# Altium schematic sheet Tay_Cam.SchDoc (part 3 of 3)
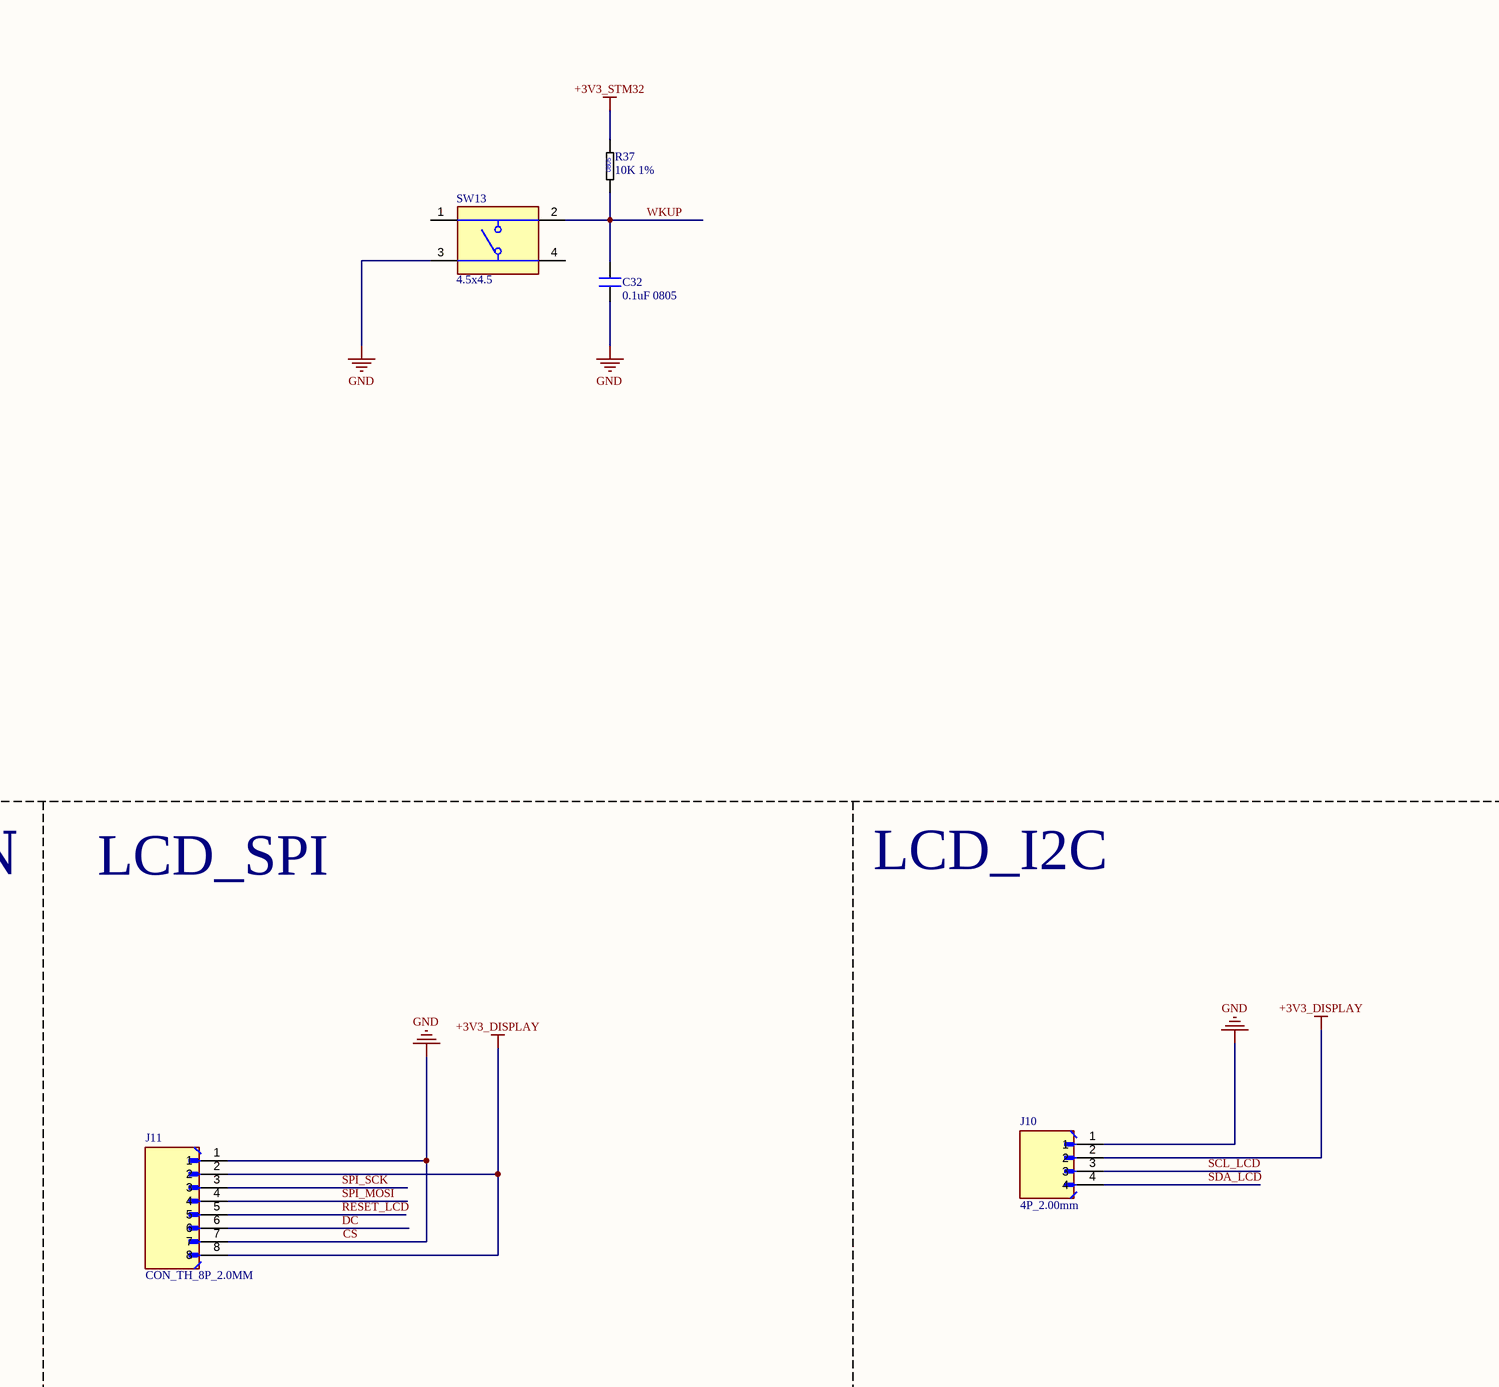
[diagram p9: Tay_Cam.SchDoc, bottom column 4 of 4]

## Library data of the parts (continued)
Q3 Q4 = TRANS-BJT_SMD; NPN 25V 1.5A SOT-23-3; SS8050-G: Trans Gp Bjt NPN 25V 1.5A 300MW 3-PIN SOT-23 T/r; Manufacturer Cross: Comchip; Transition Frequency: 100MHz; Collector-emitter Voltage-Max: 400mV; Collector Base Voltage (VCBO): 40V; Collector Emitter Saturation Voltage: 500mV; Emitter Base Voltage (VEBO): 5V; hFE Min: 200; Number of Elements: 1; LIBRARY MADE BY: MR. XUAN SIEU; Supplier 1: Digikey; Manufacturer Part Number: SS8050-G; RoHS: Yes; Category: Transistors; Stock 1: 130674; Pricing 1: 1=0.24, 10=0.148, 100=0.0921, 500=0.06754, 1000=0.05958 (USD); Mount: Surface Mount; Case/Package: TO-236-3; Max Operating Temperature: 150°C; Packaging: Cut Tape; Max Collector Current: 1.5A; Max Power Dissipation: 300mW; Collector Emitter Breakdown Voltage: 25V; Max Breakdown Voltage: 25V; Series: -; Power Dissipation: 300mW; Height: 1.15mm; RoHS Compliant: Yes; ComponentLink1URL: http://www.comchiptech.com/admin/files/product/SS8050-G RevA181526.pdf?src-supplier=Digikey; ComponentLink1Description: http://www.comchiptech.com/admin/files/product/SS8050-G RevA181526.pdf?src-supplier=Digikey; ComponentLink2Description: Link Viet Nam; ComponentLink2URL: https://linhkien.cxtvn.com/6446-mmss8050-l-tp-transistor-npn-25v-15a-sot-23.html; ComponentLink3Description: Link Original; ComponentLink3URL: https://www.digikey.com/en/products/detail/comchip-technology/SS8050-G/6138901; ComponentLink4Description: Link Cross; ComponentLink4URL: https://www.lcsc.com/product-detail/Bipolar-BJT_Comchip-SS8050-G_C3199946.html?s_z=n_SS8050-G; Supplier Part Number 1: 641-1790-1-ND
R1 R2 R5 R7 R19 R23 R29 = RES_SMD; 4.7K, 1%, 0805, 1/8W: Res Thick Film 0805 4.7K Ohm 1% 1/8W ±100ppm/°C Molded SMD Paper T/R; Manufacturer Cross: Vishay; Manufacturer Part Number: CRCW08054K70FKEAC; Voltage Rating: 150V; LIBRARY MADE BY: MR. XUAN SIEU; Supplier 1: Digikey; RoHS: Yes; Category: Chip SMD Resistors; Stock 1: 866093; Pricing 1: 1=0.1, 10=0.041, 100=0.0208, 1000=0.01059, 2500=0.00988, 5000=0.00661, 10000=0.00546, 15000=0.00542, 25000=0.00537, 35000=0.00535, 50000=0.00532, 125000=0.00526, 250000=0.00523, 500000=0.00519 (USD); Height: 600um; Lead Free: 5697LeadFree; ComponentLink1URL: http://www.vishay.com/docs/28773/crcwce3.pdf?src-supplier=Digikey; ComponentLink1Description: http://www.vishay.com/docs/28773/crcwce3.pdf?src-supplier=Digikey; ComponentLink2URL: https://datasheet.octopart.com/CRCW08054K70FKEAC-Vishay-datasheet-100063072.pdf?src-supplier=Future+Electronics; ComponentLink2Description: https://datasheet.octopart.com/CRCW08054K70FKEAC-Vishay-datasheet-100063072.pdf?src-supplier=Future+Electronics; ComponentLink3Description: Link Original; ComponentLink3URL: https://www.digikey.com/en/products/detail/vishay-dale/CRCW08054K70FKEAC/7928553; ComponentLink4Description: Link Cross; ComponentLink4URL: https://www.lcsc.com/product-detail/Chip-Resistor-Surface-Mount_Vishay-Intertech-CRCW08054K70FKEAC_C844630.html?s_z=n_CRCW08054K70FKEAC; ComponentLink5Description: Link Viet Nam; ComponentLink5URL: https://linhkien.cxtvn.com/11332-dien-tro-0805-1-thong-so-tu-1k-den-91k.html; Supplier Part Number 1: 541-4131-1-ND
R3 R20 = R-SM: 10kΩ 100mW 75V ±1% ±100ppm/℃ Thick Film Resistor 0603 Chip Resistor - Surface Mount ROHS; Manufacturer: YAGEO; Ten thuong mai: Dien tro dan 0603 ?K 1%; User: 1; Package: 0603; Mfr. Part #: *; Link VN: *; Link QT: *; ComponentLink1Description: New link; ComponentLink1URL: *
R4 R21 = R-SM_4: 10kΩ 100mW 75V ±1% ±100ppm/℃ Thick Film Resistor 0603 Chip Resistor - Surface Mount ROHS; Manufacturer: YAGEO; Ten thuong mai: Dien tro dan 0603 ?K 1%; User: 1; Package: 0603; Mfr. Part #: *; Link VN: *; Link QT: *; ComponentLink1Description: New link; ComponentLink1URL: *
R6 R22 = R-SM_1: 10kΩ 100mW 75V ±1% ±100ppm/℃ Thick Film Resistor 0603 Chip Resistor - Surface Mount ROHS; Manufacturer: YAGEO; Ten thuong mai: Dien tro dan 0603 ?K 1%; User: 1; Package: 0603; Mfr. Part #: *; Link VN: *; Link QT: *; ComponentLink1Description: New link; ComponentLink1URL: *
R8 R34 = RES_SMD; 47K, 1%, 0805, 1/8W: 125Mw Thick Film Resistors 100Ppm/ 1% 47K 0805 Chip Resistor Surface Mount Rohs; Manufacturer: Yageo; Manufacturer Part Number: RC0805FR-0747KL; Voltage Rating (DC): 150V; Resistance: 47kR; Temperature Coefficient: 100ppm/°C; LIBRARY MADE BY: MR. XUAN SIEU; Supplier 1: Digikey; RoHS: Yes; Category: Chip SMD Resistors; Stock 1: 133607; Pricing 1: 1=0.1, 10=0.012, 100=0.0112, 1000=0.00816 (USD); Case/Package: 0805; Number of Pins: 2; Case Code (Imperial): 0805; Case Code (Metric): 2012; Contact Plating: Tin,Matte; Size Code: 0805; Min Operating Temperature: -55°C; Max Operating Temperature: 155°C; Tolerance: 1%; Packaging: Tape and Reel; Voltage Rating: 150V; Power Rating: 125mW; Termination: SMD/SMT; Number of Terminations: 2; Voltage Rating (AC): 150V; Resistor Type: Thick Film; Features: Moisture Resistant; Max Power Dissipation: 125mW; Series: RC; Resistance Tolerance: 1%; Length: 2mm; Width: 1.25mm; Height: 0.5mm; Lead Free: 5697LeadFree; Reach SVHC Compliant: Unknown; RoHS Compliant: Yes; ComponentLink1URL: https://datasheet.ciiva.com/7941/1686128-7941799.pdf?src-supplier=Element14; ComponentLink1Description: https://datasheet.ciiva.com/7941/1686128-7941799.pdf?src-supplier=Element14; ComponentLink2URL: https://datasheet.ciiva.com/46447/444164-46447581.pdf?src-supplier=Element14; ComponentLink2Description: https://datasheet.ciiva.com/46447/444164-46447581.pdf?src-supplier=Element14; ComponentLink3URL: https://datasheet.ciiva.com/7941/444164-7941800.pdf?src-supplier=Element14; ComponentLink3Description: https://datasheet.ciiva.com/7941/444164-7941800.pdf?src-supplier=Element14; ComponentLink4URL: https://datasheet.ciiva.com/7941/444164-7941801.pdf?src-supplier=Element14; ComponentLink4Description: https://datasheet.ciiva.com/7941/444164-7941801.pdf?src-supplier=Element14; ComponentLink5URL: https://datasheet.ciiva.com/16742/rc0805-16742265.pdf?src-supplier=Future+Electronics; ComponentLink5Description: https://datasheet.ciiva.com/16742/rc0805-16742265.pdf?src-supplier=Future+Electronics; Link Viet Nam: https://linhkien.cxtvn.com/1960-dien-tro-0805-5-thong-so-tu-1k-den-91k.html; Link Original: https://www.digikey.com/en/products/detail/yageo/RC0805FR-0747KL/727973; Supplier Part Number 1: 311-47.0KCRCT-ND
R9 R24 = R-SM_5: 10kΩ 100mW 75V ±1% ±100ppm/℃ Thick Film Resistor 0603 Chip Resistor - Surface Mount ROHS; Manufacturer: YAGEO; Ten thuong mai: Dien tro dan 0603 ?K 1%; User: 1; Package: 0603; Mfr. Part #: *; Link VN: *; Link QT: *; ComponentLink1Description: New link; ComponentLink1URL: *
R10 R28 = R-SM_2: 10kΩ 100mW 75V ±1% ±100ppm/℃ Thick Film Resistor 0603 Chip Resistor - Surface Mount ROHS; Manufacturer: YAGEO; Ten thuong mai: Dien tro dan 0603 ?K 1%; User: 1; Package: 0603; Mfr. Part #: *; Link VN: *; Link QT: *; ComponentLink1Description: New link; ComponentLink1URL: *
R11 R26 R32 R35 R37-R39 R43 = RES_SMD; 10K, 1%, 0805, 1/8W: SMD Chip Resistor, 10 kOhm, ± 1%, 125 mW, 0805 [2012 Metric], Thick Film, General Purpose; Manufacturer Cross: Stackpole Electronics; Manufacturer Part Number: RMCF0805FT10K0; Voltage Rating: 150V; LIBRARY MADE BY: MR. XUAN SIEU; Supplier 1: Digikey; RoHS: Yes; Category: Chip SMD Resistors; Stock 1: 1959497; Pricing 1: 1=0.1, 10=0.02, 50=0.0124, 100=0.0103, 500=0.007, 1000=0.00601 (USD); Lead Free: 5697LeadFree; ComponentLink1URL: https://datasheet.ciiva.com/15193/getdatasheetpartid-362046-15193525.pdf?src-supplier=Verical; ComponentLink1Description: https://datasheet.ciiva.com/15193/getdatasheetpartid-362046-15193525.pdf?src-supplier=Verical; Supplier Part Number 1: RMCF0805FT10K0CT-ND; ComponentLink2Description: Link Original; ComponentLink2URL: https://www.digikey.com/en/products/detail/stackpole-electronics-inc/RMCF0805FT10K0/1760676; ComponentLink3Description: Link Cross; ComponentLink3URL: https://www.lcsc.com/product-detail/Chip-Resistor-Surface-Mount_SEI-Stackpole-Elec-RMCF0805FT10K0_C237755.html; ComponentLink4Description: Link Viet Nam; ComponentLink4URL: https://linhkien.cxt.vn/8484-rc0805fr-0710kl-res-10k-ohm-1-18w-0805.html
R12-R14 R16 R18 = RES_SMD; 22R, 1%, 0805, 1/8W: SMD Chip Resistor, 22 Ohm, ± 1%, 125 mW, 0805 [2012 Metric], Thick Film, General Purpose; Manufacturer Cross: Yageo; Manufacturer Part Number: RC0805FR-0722RL; Voltage Rating (AC): 150V; LIBRARY MADE BY: MR. XUAN SIEU; Supplier 1: Digikey; RoHS: Yes; Category: Chip SMD Resistors; Stock 1: 280945; Pricing 1: 1=0.1, 10=0.012, 100=0.0112, 1000=0.00918, 5000=0.00408, 10000=0.00357, 15000=0.00355, 500000=0.00338 (USD); Lead Free: 5697LeadFree; ComponentLink1URL: https://datasheet.ciiva.com/11819/0900766b8106beab-11819837.pdf?src-supplier=Rs; ComponentLink1Description: https://datasheet.ciiva.com/11819/0900766b8106beab-11819837.pdf?src-supplier=Rs; ComponentLink2URL: https://datasheet.ciiva.com/2457/pyu-r-int-thick-7-2457045.pdf?src-supplier=Digikey; ComponentLink2Description: https://datasheet.ciiva.com/2457/pyu-r-int-thick-7-2457045.pdf?src-supplier=Digikey; ComponentLink3URL: https://datasheet.ciiva.com/2457/pyu-r-int-thick-7-2457046.pdf?src-supplier=Digikey; ComponentLink3Description: https://datasheet.ciiva.com/2457/pyu-r-int-thick-7-2457046.pdf?src-supplier=Digikey; ComponentLink4URL: https://datasheet.ciiva.com/12667/rc0805-12667371.pdf?src-supplier=Mouser; ComponentLink4Description: https://datasheet.ciiva.com/12667/rc0805-12667371.pdf?src-supplier=Mouser; ComponentLink5URL: https://datasheet.ciiva.com/2457/pyu-r-int-thick-7-2457044.pdf?src-supplier=Digikey; ComponentLink5Description: https://datasheet.ciiva.com/2457/pyu-r-int-thick-7-2457044.pdf?src-supplier=Digikey; ComponentLink6URL: https://datasheet.ciiva.com/46447/444164-46447574.pdf?src-supplier=Element14; ComponentLink6Description: https://datasheet.ciiva.com/46447/444164-46447574.pdf?src-supplier=Element14; ComponentLink7Description: Link Original; ComponentLink7URL: https://www.digikey.com/en/products/detail/yageo/RC0805FR-0722RL/727735; ComponentLink8Description: Link Cross; ComponentLink8URL: https://www.lcsc.com/product-detail/Chip-Resistor-Surface-Mount_YAGEO-RC0805FR-0722RL_C107702.html?s_z=n_RC0805FR-0722RL; ComponentLink9Description: Link Viet Nam; ComponentLink9URL: https://linhkien.cxtvn.com/10363-dien-tro-0805-1-thong-so-tu-0r-den-910r.html; Supplier Part Number 1: 311-22.0CRCT-ND
R15 R17 = RES_SMD; 2.2K, 1%, 0805, 1/8W: Res Thick Film 0805 2.2K Ohm 1% 0.125W(1/8W) ±100ppm/C Pad SMD T/R; Manufacturer Cross: TE Connectivity; Manufacturer Part Number: CRG0805F2K2; Resistance: 2.2kR; Power Rating: 125mW; Voltage Rating: 150V; Temperature Coefficient: 100ppm/°C; Number of Resistors: 1; LIBRARY MADE BY: MR. XUAN SIEU; Supplier 1: Digikey; RoHS: Yes; Category: Chip SMD Resistors; Stock 1: 293904; Pricing 1: 1=0.1, 10=0.035, 100=0.0179, 1000=0.01031, 2500=0.00862 (USD); Mount: Surface Mount; Case/Package: 0805; Case Code (Imperial): 0805; Case Code (Metric): 2012; Weight: 0.000194oz; Min Operating Temperature: -55°C; Max Operating Temperature: 125°C; Tolerance: 1%; Packaging: Tape and Reel; Resistor Type: Thick Film; Package Quantity: 5000; Termination: Solder; Number of Terminations: 2; Series: CRG; Technology: THICK FILM; Max Power Dissipation: 125mW; Voltage Rating (DC): 150V; Operating Supply Voltage: 150V; Length: 2mm; Width: 1.25mm; Height: 0.55mm; Depth: 1.25mm; ELV: Compliant; RoHS Compliant: Yes; Military Standard: Not; ComponentLink1URL: https://datasheet.ciiva.com/11809/0900766b800a696e-11809606.pdf?src-supplier=Rs; ComponentLink1Description: https://datasheet.ciiva.com/11809/0900766b800a696e-11809606.pdf?src-supplier=Rs; ComponentLink2URL: https://datasheet.ciiva.com/30142/eng-ds-1773204-e-30142790.pdf?src-supplier=Onlinecomponents.com; ComponentLink2Description: https://datasheet.ciiva.com/30142/eng-ds-1773204-e-30142790.pdf?src-supplier=Onlinecomponents.com; ComponentLink3URL: https://datasheet.ciiva.com/5547/eng-ds-1773204-g-5547934.pdf?src-supplier=Mouser; ComponentLink3Description: https://datasheet.ciiva.com/5547/eng-ds-1773204-g-5547934.pdf?src-supplier=Mouser; Supplier Part Number 1: A106060CT-ND; ComponentLink4Description: Link Original; ComponentLink4URL: https://www.digikey.com/en/products/detail/te-connectivity-passive-product/CRG0805F2K2/2135487; ComponentLink5Description: Link Cross; ComponentLink5URL: https://www.lcsc.com/product-detail/Chip-Resistor-Surface-Mount_TE-Connectivity-CRG0805F2K2_C2073912.html?s_z=n_CRG0805F2K2; ComponentLink6Description: Link Viet Nam; ComponentLink6URL: https://linhkien.cxtvn.com/5089-dien-tro-0805-1-thong-so-tu-1k-den-91k.html
R25 R27 R30 R46 = RES_SMD; 47K, 1%, 0805, 1/8W_1: 125Mw Thick Film Resistors 100Ppm/ 1% 47K 0805 Chip Resistor Surface Mount Rohs; Manufacturer: Yageo; Manufacturer Part Number: RC0805FR-0747KL; Voltage Rating (DC): 150V; Resistance: 47kR; Temperature Coefficient: 100ppm/°C; LIBRARY MADE BY: MR. XUAN SIEU; Supplier 1: Digikey; RoHS: Yes; Category: Chip SMD Resistors; Stock 1: 133607; Pricing 1: 1=0.1, 10=0.012, 100=0.0112, 1000=0.00816 (USD); Case/Package: 0805; Number of Pins: 2; Case Code (Imperial): 0805; Case Code (Metric): 2012; Contact Plating: Tin,Matte; Size Code: 0805; Min Operating Temperature: -55°C; Max Operating Temperature: 155°C; Tolerance: 1%; Packaging: Tape and Reel; Voltage Rating: 150V; Power Rating: 125mW; Termination: SMD/SMT; Number of Terminations: 2; Voltage Rating (AC): 150V; Resistor Type: Thick Film; Features: Moisture Resistant; Max Power Dissipation: 125mW; Series: RC; Resistance Tolerance: 1%; Length: 2mm; Width: 1.25mm; Height: 0.5mm; Lead Free: 5697LeadFree; Reach SVHC Compliant: Unknown; RoHS Compliant: Yes; ComponentLink1URL: https://datasheet.ciiva.com/7941/1686128-7941799.pdf?src-supplier=Element14; ComponentLink1Description: https://datasheet.ciiva.com/7941/1686128-7941799.pdf?src-supplier=Element14; ComponentLink2URL: https://datasheet.ciiva.com/46447/444164-46447581.pdf?src-supplier=Element14; ComponentLink2Description: https://datasheet.ciiva.com/46447/444164-46447581.pdf?src-supplier=Element14; ComponentLink3URL: https://datasheet.ciiva.com/7941/444164-7941800.pdf?src-supplier=Element14; ComponentLink3Description: https://datasheet.ciiva.com/7941/444164-7941800.pdf?src-supplier=Element14; ComponentLink4URL: https://datasheet.ciiva.com/7941/444164-7941801.pdf?src-supplier=Element14; ComponentLink4Description: https://datasheet.ciiva.com/7941/444164-7941801.pdf?src-supplier=Element14; ComponentLink5URL: https://datasheet.ciiva.com/16742/rc0805-16742265.pdf?src-supplier=Future+Electronics; ComponentLink5Description: https://datasheet.ciiva.com/16742/rc0805-16742265.pdf?src-supplier=Future+Electronics; Link Viet Nam: https://linhkien.cxtvn.com/1960-dien-tro-0805-5-thong-so-tu-1k-den-91k.html; Link Original: https://www.digikey.com/en/products/detail/yageo/RC0805FR-0747KL/727973; Supplier Part Number 1: 311-47.0KCRCT-ND
R31 R44 = RES_SMD; 100K, 1%, 0805, 1/8W: SMD Chip Resistor, 100 kOhm, ï¿½ 1%, 125 mW, 0805 [2012 Metric], Thick Film, General Purpose; Manufacturer Cross: Yageo; Manufacturer Part Number: RC0805FR-07100KL; Resistance: 100kR; Power Rating: 125mW; Voltage Rating: 150V; Temperature Coefficient: 100ppm/°C; LIBRARY MADE BY: MR. XUAN SIEU; Supplier 1: Digikey; RoHS: Yes; Category: Chip SMD Resistors; Stock 1: 541448; Pricing 1: 1=0.1, 10=0.014, 100=0.0112, 1000=0.00918 (USD); Case/Package: 0805; Number of Pins: 2; Case Code (Metric): 2012; Case Code (Imperial): 0805; Size Code: 0805; Min Operating Temperature: -55°C; Max Operating Temperature: 155°C; Tolerance: 1%; Package Quantity: 1; Packaging: Tape and Reel; Resistor Type: Thick Film; Number of Terminations: 2; Termination: SMD/SMT; Max Power Dissipation: 125mW; Features: Moisture Resistant; Series: RC; Construction: Rectangular; Resistance Tolerance: 1%; Voltage Rating (AC): 150V; Voltage Rating (DC): 150V; Technology: THICK FILM; Length: 0.079inch; Width: 0.049inch; Height: 0.024inch; Depth: 1.25mm; Lead Pitch: 0.4mm; Military Standard: Not; RoHS Compliant: Yes; Reach SVHC Compliant: Unknown; Lead Free: 5697LeadFree; ComponentLink1URL: https://datasheet.ciiva.com/11808/0900766b8106beab-11808858.pdf?src-supplier=Rs; ComponentLink1Description: https://datasheet.ciiva.com/11808/0900766b8106beab-11808858.pdf?src-supplier=Rs; ComponentLink2URL: https://datasheet.ciiva.com/7941/1686128-7941677.pdf?src-supplier=Element14; ComponentLink2Description: https://datasheet.ciiva.com/7941/1686128-7941677.pdf?src-supplier=Element14; ComponentLink3URL: https://datasheet.ciiva.com/7660/38627-7660796.pdf?src-supplier=Element14; ComponentLink3Description: https://datasheet.ciiva.com/7660/38627-7660796.pdf?src-supplier=Element14; ComponentLink4URL: https://datasheet.ciiva.com/22747/444164-22747534.pdf?src-supplier=Element14; ComponentLink4Description: https://datasheet.ciiva.com/22747/444164-22747534.pdf?src-supplier=Element14; ComponentLink5URL: https://datasheet.ciiva.com/2457/pyu-r-int-thick-7-2457018.pdf?src-supplier=Digikey; ComponentLink5Description: https://datasheet.ciiva.com/2457/pyu-r-int-thick-7-2457018.pdf?src-supplier=Digikey; ComponentLink6URL: https://datasheet.ciiva.com/2457/pyu-r-int-thick-7-2457019.pdf?src-supplier=Digikey; ComponentLink6Description: https://datasheet.ciiva.com/2457/pyu-r-int-thick-7-2457019.pdf?src-supplier=Digikey; ComponentLink7URL: https://datasheet.ciiva.com/2457/pyu-r-int-thick-7-2457017.pdf?src-supplier=Digikey; ComponentLink7Description: https://datasheet.ciiva.com/2457/pyu-r-int-thick-7-2457017.pdf?src-supplier=Digikey; ComponentLink8URL: https://datasheet.ciiva.com/12667/rc0805-12667001.pdf?src-supplier=Mouser; ComponentLink8Description: https://datasheet.ciiva.com/12667/rc0805-12667001.pdf?src-supplier=Mouser; ComponentLink9URL: https://datasheet.ciiva.com/7941/1697719-7941676.pdf?src-supplier=Element14; ComponentLink9Description: https://datasheet.ciiva.com/7941/1697719-7941676.pdf?src-supplier=Element14; ComponentLink10URL: https://datasheet.ciiva.com/7941/1697719-7941678.pdf?src-supplier=Element14; ComponentLink10Description: https://datasheet.ciiva.com/7941/1697719-7941678.pdf?src-supplier=Element14; ComponentLink11URL: https://datasheet.ciiva.com/16747/rc0805-16747226.pdf?src-supplier=Future+Electronics; ComponentLink11Description: https://datasheet.ciiva.com/16747/rc0805-16747226.pdf?src-supplier=Future+Electronics; Supplier Part Number 1: 311-100KCRCT-ND; ComponentLink12Description: Link Original; ComponentLink12URL: https://www.digikey.com/en/products/detail/yageo/RC0805FR-07100KL/727544; ComponentLink13Description: Link Cross; ComponentLink13URL: https://www.lcsc.com/product-detail/Chip-Resistor-Surface-Mount_YAGEO-RC0805FR-07100KL_C96346.html?s_z=n_RC0805FR-07100KL; ComponentLink14Description: Link Viet Nam; ComponentLink14URL: https://linhkien.cxtvn.com/10639-dien-tro-0805-1-thong-so-tu-100k-den-910k.html
R33 = RES_SMD; 330R, 1%, 0805, 1/8W: Res Thick Film 0805 330 Ohm 1% 0.125W ±100ppm/°C Molded SMD Paper T/R; Manufacturer: Stackpole Electronics; Manufacturer Part Number: RMCF0805FT330R; LIBRARY MADE BY: MR. XUAN SIEU; Supplier 1: Digikey; RoHS: Yes; Category: Chip SMD Resistors; Stock 1: 325760; Pricing 1: 1=0.1, 10=0.02, 50=0.0124, 100=0.0103, 500=0.007, 1000=0.00601 (USD); ComponentLink1URL: http://components.arrow.com/part/dataview/40963487S9848862N1174?src-supplier=Arrow+Electronics; ComponentLink1Description: http://components.arrow.com/part/dataview/40963487S9848862N1174?src-supplier=Arrow+Electronics; ComponentLink2URL: https://datasheet.octopart.com/RMCF0805FT330R-Stackpole-Electronics-datasheet-12534581.pdf?src-supplier=Future+Electronics; ComponentLink2Description: https://datasheet.octopart.com/RMCF0805FT330R-Stackpole-Electronics-datasheet-12534581.pdf?src-supplier=Future+Electronics; ComponentLink3URL: https://www.verical.com/server-webapp/html/getDatasheet?partID=559884&src-supplier=Verical; ComponentLink3Description: https://www.verical.com/server-webapp/html/getDatasheet?partID=559884&src-supplier=Verical; ComponentLink4URL: https://www.seielect.com/Catalog/SEI-RMCF_RMCP.pdf?src-supplier=Digikey; ComponentLink4Description: https://www.seielect.com/Catalog/SEI-RMCF_RMCP.pdf?src-supplier=Digikey; ComponentLink5URL: https://www.seielect.com/catalog/SEI-RMCF_RMCP.pdf?src-supplier=Avnet; ComponentLink5Description: https://www.seielect.com/catalog/SEI-RMCF_RMCP.pdf?src-supplier=Avnet; ComponentLink6URL: https://www.seielect.com/catalog/SEI-Packaging.pdf?src-supplier=Digikey; ComponentLink6Description: https://www.seielect.com/catalog/SEI-Packaging.pdf?src-supplier=Digikey; Supplier Part Number 1: RMCF0805FT330RCT-ND; LINK VIET NAM: https://linhkien.cxtvn.com/2743-dien-tro-330r-0805-1-50c.html; LINK ORIGINAL: https://www.digikey.com/en/products/detail/stackpole-electronics-inc/RMCF0805FT330R/1760484?s=N4IgTCBcDaIEoFkDCAxADADjQVhQFQGYC04QBdAXyA
R36 = R-SM_3: 10kΩ 100mW 75V ±1% ±100ppm/℃ Thick Film Resistor 0603 Chip Resistor - Surface Mount ROHS; Manufacturer: YAGEO; Ten thuong mai: Dien tro dan 0603 ?K 1%; User: 1; Package: 0603; Mfr. Part #: *; Link VN: *; Link QT: *; ComponentLink1Description: New link; ComponentLink1URL: *
R40 R42 = RES_SMD; 1K, 1%, 0805, 1/8W: 1K / SIMPLE SWITCHER® 4.5V to 40V, 3A Low Component Count Step-Down Regulator 5-DDPAK/TO-263; Manufacturer Cross: Stackpole Electronics; Manufacturer Part Number: RNCP0805FTD1K00; LIBRARY MADE BY: MR. XUAN SIEU; Supplier 1: Digikey; RoHS: Yes; Category: Chip SMD Resistors; Stock 1: 269005; Pricing 1: 1=0.1, 10=0.015, 50=0.013, 100=0.0114, 500=0.01006, 5000=0.00916, 10000=0.00844, 15000=0.00807, 25000=0.00749, 35000=0.00693, 50000=0.00637, 125000=0.0063 (USD); ComponentLink1URL: http://www.seielect.com/Catalog/SEI-rncp.pdf?src-supplier=Future+Electronics; ComponentLink1Description: http://www.seielect.com/Catalog/SEI-rncp.pdf?src-supplier=Future+Electronics; ComponentLink2URL: https://www.seielect.com/catalog/SEI-Packaging.pdf?src-supplier=Digikey; ComponentLink2Description: https://www.seielect.com/catalog/SEI-Packaging.pdf?src-supplier=Digikey; ComponentLink3URL: https://www.seielect.com/Catalog/SEI-rncp.pdf?src-supplier=Digikey; ComponentLink3Description: https://www.seielect.com/Catalog/SEI-rncp.pdf?src-supplier=Digikey; Supplier Part Number 1: RNCP0805FTD1K00CT-ND; ComponentLink4Description: Link Original; ComponentLink4URL: https://www.digikey.com/en/products/detail/stackpole-electronics-inc/RNCP0805FTD1K00/2240229; ComponentLink5Description: Link Cross; ComponentLink5URL: https://www.lcsc.com/product-detail/Chip-Resistor-Surface-Mount_SEI-Stackpole-Elec-RNCP0805FTD1K00_C2441430.html?s_z=n_RNCP0805FTD1K00; ComponentLink6Description: Link Viet Nam; ComponentLink6URL: https://linhkien.cxtvn.com/2346-dien-tro-0805-1-thong-so-tu-1k-den-91k.html
R41 R45 = RES_SMD; 100r, 1%, 0805, 1/8W_1: 100 Ohms ±1% 0.125W, 1/8W Chip Resistor 0805 (2012 Metric) Moisture Resistant Thick Film; Manufacturer: Yageo; Manufacturer Part Number: RC0805FR-07470RL; Resistance: 470R; Voltage Rating (DC): 150V; Temperature Coefficient: 100ppm/°C; Power Rating: 125mW; LIBRARY MADE BY: MR. XUAN SIEU; Supplier 1: Digikey; RoHS: Yes; Category: Chip SMD Resistors; Stock 1: 303363; Pricing 1: 1=0.1, 10=0.012, 100=0.0112, 1000=0.00714 (USD); Case/Package: 0805; Number of Pins: 2; Case Code (Imperial): 0805; Case Code (Metric): 2012; Size Code: 0805; Min Operating Temperature: -55°C; Max Operating Temperature: 155°C; Tolerance: 1%; Packaging: Tape and Reel; Voltage Rating (AC): 150V; Voltage Rating: 150V; Resistor Type: Thick Film; Number of Terminations: 2; Termination: SMD/SMT; Max Power Dissipation: 125mW; Features: Moisture Resistant; Package Quantity: 5000; Series: RC; Resistance Tolerance: 1%; Construction: Rectangular; Length: 2mm; Width: 1.25mm; Height: 0.5mm; Depth: 1.25mm; Lead Pitch: 0.4mm; Lead Free: Lead Free; Reach SVHC Compliant: Unknown; RoHS Compliant: Yes; ComponentLink1URL: https://datasheet.ciiva.com/46447/444164-46447580.pdf?src-supplier=Element14; ComponentLink1Description: https://datasheet.ciiva.com/46447/444164-46447580.pdf?src-supplier=Element14; ComponentLink2URL: https://datasheet.ciiva.com/2457/pyu-r-int-thick-7-2457057.pdf?src-supplier=Digikey; ComponentLink2Description: https://datasheet.ciiva.com/2457/pyu-r-int-thick-7-2457057.pdf?src-supplier=Digikey; ComponentLink3URL: https://datasheet.ciiva.com/2457/pyu-r-int-thick-7-2457058.pdf?src-supplier=Digikey; ComponentLink3Description: https://datasheet.ciiva.com/2457/pyu-r-int-thick-7-2457058.pdf?src-supplier=Digikey; ComponentLink4URL: https://datasheet.ciiva.com/2457/pyu-r-int-thick-7-2457056.pdf?src-supplier=Digikey; ComponentLink4Description: https://datasheet.ciiva.com/2457/pyu-r-int-thick-7-2457056.pdf?src-supplier=Digikey; ComponentLink5URL: https://datasheet.ciiva.com/7941/444164-7941798.pdf?src-supplier=Element14; ComponentLink5Description: https://datasheet.ciiva.com/7941/444164-7941798.pdf?src-supplier=Element14; ComponentLink6URL: https://datasheet.ciiva.com/7941/444164-7941797.pdf?src-supplier=Element14; ComponentLink6Description: https://datasheet.ciiva.com/7941/444164-7941797.pdf?src-supplier=Element14; ComponentLink7URL: https://datasheet.ciiva.com/16745/rc0805-16745229.pdf?src-supplier=Future+Electronics; ComponentLink7Description: https://datasheet.ciiva.com/16745/rc0805-16745229.pdf?src-supplier=Future+Electronics; Supplier Part Number 1: 311-470CRCT-ND; LINK ORIGINAL: https://www.digikey.com/en/products/detail/yageo/RC0805FR-07470RL/727976; LINK VIET NAM: https://linhkien.cxtvn.com/2345-dien-tro-0805-1-thong-so-tu-0r-den-910r.html
RC1 = RES_SMD; 0R 5% 1/8W 0805: 0 Ohms Jumper Chip Resistor 0805 (2012 Metric) Anti-Sulfur, Automotive AEC-Q200, Moisture Resistant Thick Film; Manufacturer Cross: Bourns; Manufacturer Part Number: CR0805AJ/-000EAS; Power Rating: 125mW; Tolerance: 5%; Voltage Rating: 150V; LIBRARY MADE BY: MR. XUAN SIEU; Supplier 1: Digikey; RoHS: Yes; Category: Chip SMD Resistors; Stock 1: 21112; Pricing 1: 1=0.1, 10=0.034, 50=0.0212, 100=0.0177, 500=0.01208, 1000=0.01043 (USD); Case/Package: 339Case; Min Operating Temperature: -55°C; Max Operating Temperature: 155°C; Resistance: 0R; Voltage Rating (DC): 150V; Height: 600um; ComponentLink1URL: https://www.bourns.com/docs/product-datasheets/crxxxxa-as.pdf?src-supplier=Digikey; ComponentLink1Description: https://www.bourns.com/docs/product-datasheets/crxxxxa-as.pdf?src-supplier=Digikey; ComponentLink2URL: https://datasheet.octopart.com/CR0805AJ--000EAS-Bourns-datasheet-166097895.pdf?src-supplier=Electro+Sonic; ComponentLink2Description: https://datasheet.octopart.com/CR0805AJ--000EAS-Bourns-datasheet-166097895.pdf?src-supplier=Electro+Sonic; ComponentLink3Description: Link Viet Nam; ComponentLink3URL: https://linhkien.cxtvn.com/2899-dien-tro-0805-1-thong-so-tu-0r-den-910r.html; ComponentLink4Description: Link Original; ComponentLink4URL: https://www.digikey.com/en/products/detail/bourns-inc/CR0805AJ-000EAS/10240129; ComponentLink5Description: Link Cross; ComponentLink5URL: https://www.lcsc.com/product-detail/Chip-Resistor-Surface-Mount_BOURNS-CR0805AJ-000EAS_C4183615.html?s_z=n_CR0805AJ%2F-000EAS; Supplier Part Number 1: CR0805AJ/-000EASCT-ND
SW1-SW13 = SWITCH-SMD;4P,TACTILE,4.5x4.5mm: Switch Tactile N.O. SPST Round Button Gull Wing 0.05A 12VDC 100000Cycles 1.57N SMD T/R; Manufacturer Cross: ITT C&K; Manufacturer Part Number: PTS645SM43SMTR92LFS; Actuator Material: Nylon,Polyamide,PA66; Max Voltage Rating (DC): 12V; Operating Force: 160gf; Contact Resistance: 100mR; Max Current Rating: 50mA; Illumination Type: Non-Illuminated,Illuminated; Switch Function: Off-Mom; Actuator Type: Standard; Number of Positions: 2NUMBER; Actuator Length: 0.85mm; LIBRARY MADE BY: MR. XUAN SIEU; Supplier 1: Digikey; RoHS: Yes; Category: Tactile Switches; Stock 1: 156005; Pricing 1: 1=0.32, 10=0.275, 25=0.2576, 100=0.2307, 250=0.2138, 500=0.20176, 1000=0.19654, 2000=0.18817, 3000=0.18341, 5000=0.17758, 7000=0.17383, 10000=0.16994, 25000=0.1603, 50000=0.15336 (USD); Mount: Surface Mount; Case/Package: SMD/SMT; Contact Plating: Silver; Contact Material: Silver; Mechanical Life: 100000Cycles; Color: Black; Min Operating Temperature: -20°C; Max Operating Temperature: 60°C; Throw Configuration: SPST; Packaging: Tape and Reel; Termination: Gull Wing; Package Quantity: 1; Current Rating: 50mA; Voltage Rating (DC): 12V; Orientation: Straight; Series: PTS645; Contact Current Rating: 50mA; Length: 6mm; Depth: 9mm; Size: 6mm; RoHS Compliant: Yes; Lead Free: 5697LeadFree; Reach SVHC Compliant: No; ComponentLink1URL: https://datasheet.ciiva.com/29931/getdatasheetpartid-764615-29931183.pdf?src-supplier=Verical; ComponentLink1Description: https://datasheet.ciiva.com/29931/getdatasheetpartid-764615-29931183.pdf?src-supplier=Verical; ComponentLink2URL: https://datasheet.ciiva.com/29903/getdatasheetpartid-786341-29903846.pdf?src-supplier=Verical; ComponentLink2Description: https://datasheet.ciiva.com/29903/getdatasheetpartid-786341-29903846.pdf?src-supplier=Verical; ComponentLink3URL: https://datasheet.ciiva.com/14920/pts645-14920734.pdf?src-supplier=Digikey; ComponentLink3Description: https://datasheet.ciiva.com/14920/pts645-14920734.pdf?src-supplier=Digikey; ComponentLink4URL: https://datasheet.ciiva.com/14920/pts645-14920735.pdf?src-supplier=Digikey; ComponentLink4Description: https://datasheet.ciiva.com/14920/pts645-14920735.pdf?src-supplier=Digikey; ComponentLink5URL: https://datasheet.ciiva.com/14920/pts645-14920733.pdf?src-supplier=Digikey; ComponentLink5Description: https://datasheet.ciiva.com/14920/pts645-14920733.pdf?src-supplier=Digikey; ComponentLink6Description: Link Original; ComponentLink6URL: https://www.digikey.com/en/products/detail/c-k/PTS645SM43SMTR92-LFS/1146840; ComponentLink7Description: Link Cross; ComponentLink7URL: https://www.lcsc.com/product-detail/Tactile-Switches_C-K-PTS645SM43SMTR92LFS_C221880.html?s_z=n_PTS645SM43SMTR92%2520LFS; ComponentLink8Description: Link Viet Nam; ComponentLink8URL: https://linhkien.cxtvn.com/3386-nut-nhan-4p-smd.html; Supplier Part Number 1: CKN9112CT-ND
T1 = SQ2389ES-T1_BE3: MOSFET, P-CH, 40V, 4.1A, SOT-23; Transistor Polarity:P Channel; Drain Source Voltage Vds:40V; Continuous Drain Current Id:4.1A; On Resistance Rds(on):0.084ohm; Transistor Mounting:Surface Mount; Rds(on) Test Voltage Vgs:10V; MF: Vishay; Package: SOT-23 Vishay; Price: None; Check_prices: https://www.snapeda.com/parts/SQ2389ES-T1_BE3/Vishay/view-part/?ref=eda; Value: *; SnapEDA_Link: https://www.snapeda.com/parts/SQ2389ES-T1_BE3/Vishay/view-part/?ref=snap; MP: SQ2389ES-T1_BE3; Availability: In Stock; Purchase-URL: https://pricing.snapeda.com/search?q=SQ2389ES-T1_BE3&ref=eda
U1 U2 = LMR16006XDDCR: SIMPLE SWITCHERÂ® 4V to 60V, 600mA Step-Down Regulator with Low Iq
U4 = STM32F103C8T6: ARM® Cortex®-M3 STM32F1 Microcontroller IC 32-Bit 72MHz 64KB (64K x 8) FLASH 48-LQFP (7x7); MF: STMicroelectronics; SnapEDA_Link: https://www.snapeda.com/parts/STM32F103C8T6/STMicroelectronics/view-part/?ref=snap; Package: LQFP-48 STMicroelectronics; Value: *; MP: STM32F103C8T6; Check_prices: https://www.snapeda.com/parts/STM32F103C8T6/STMicroelectronics/view-part/?ref=eda
Y1 = ABL-12.000MHZ-B2: HC/49US (AT49) MICROPROCESSOR CRYSTAL; MF: Abracon; SnapEDA_Link: https://www.snapeda.com/parts/ABL-12.000MHZ-B2/Abracon+LLC/view-part/?ref=snap; Purchase-URL: https://pricing.snapeda.com/search/part/ABL-12.000MHZ-B2/?ref=eda; MP: ABL-12.000MHZ-B2; Value: *; Check_prices: https://www.snapeda.com/parts/ABL-12.000MHZ-B2/Abracon+LLC/view-part/?ref=eda; Digi-Key_Part_Number: 535-9037-ND; Package: HC-49/US ABRACON